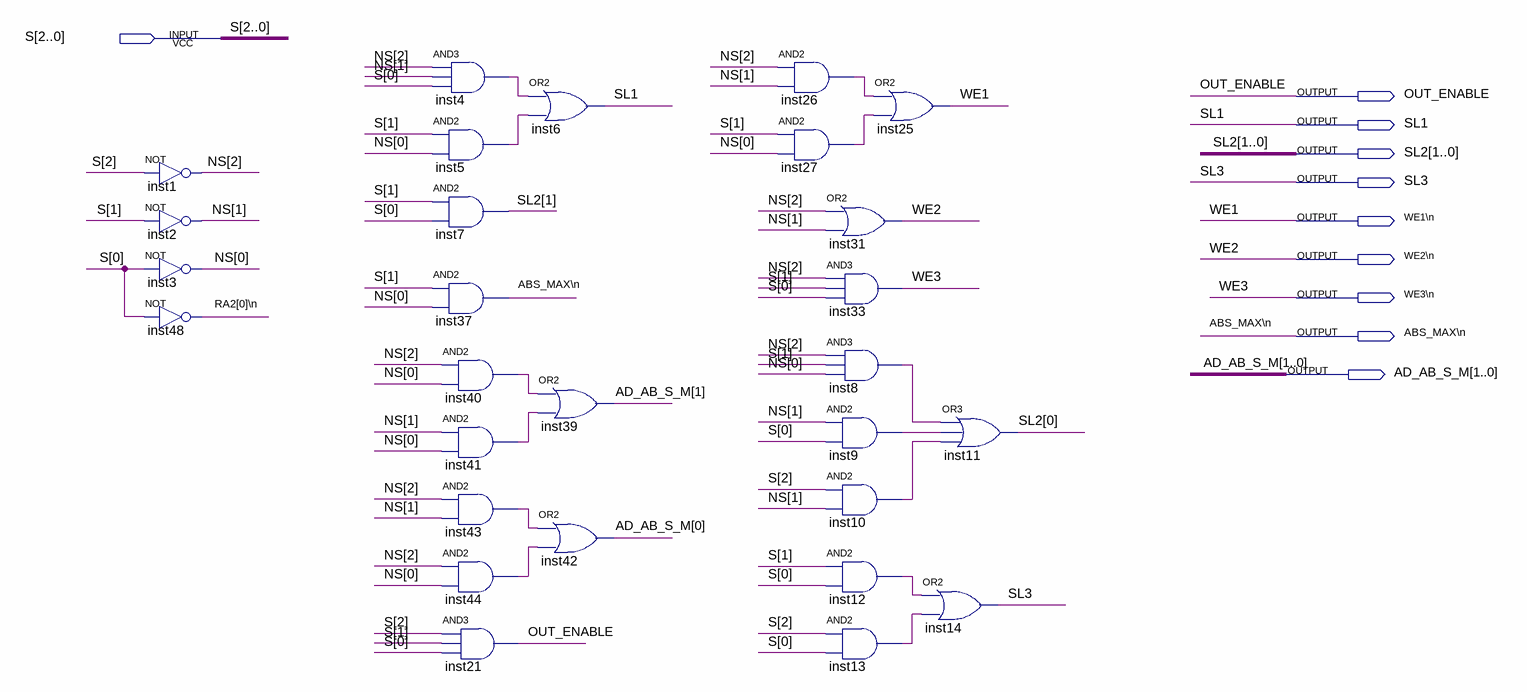
[diagram p0: schematic sheet]
// Quartus schematic sra_control.bdf as structural Verilog: 28 symbols, 10 pins
module sra_control (
  input  [2:0] S,
  output OUT_ENABLE,
  output SL1,
  output [1:0] SL2,
  output SL3,
  output \WE1\n ,
  output \WE2\n ,
  output \WE3\n ,
  output \ABS_MAX\n ,
  output [1:0] AD_AB_S_M
);

  wire inst4_out, inst5_out, inst8_out, inst9_out, inst10_out, inst12_out, inst13_out, inst26_out,
       inst27_out, inst40_out, inst41_out, inst43_out, inst44_out, \RA2[0]\n ;
  wire [2:0] NS;

  not inst1 (NS[2], S[2]);
  not inst2 (NS[1], S[1]);
  not inst3 (NS[0], S[0]);
  not inst48 (\RA2[0]\n , S[0]);
  and inst4 (inst4_out, NS[2], NS[1], S[0]);
  and inst5 (inst5_out, S[1], NS[0]);
  and inst7 (SL2[1], S[1], S[0]);
  and inst37 (\ABS_MAX\n , S[1], NS[0]);
  and inst40 (inst40_out, NS[2], NS[0]);
  and inst41 (inst41_out, NS[1], NS[0]);
  and inst43 (inst43_out, NS[2], NS[1]);
  and inst44 (inst44_out, NS[2], NS[0]);
  and inst21 (OUT_ENABLE, S[2], S[1], S[0]);
  or inst6 (SL1, inst4_out, inst5_out);
  or inst39 (AD_AB_S_M[1], inst40_out, inst41_out);
  or inst42 (AD_AB_S_M[0], inst43_out, inst44_out);
  and inst26 (inst26_out, NS[2], NS[1]);
  and inst27 (inst27_out, S[1], NS[0]);
  or inst25 (\WE1\n , inst26_out, inst27_out);
  or inst31 (\WE2\n , NS[2], NS[1]);
  and inst33 (\WE3\n , NS[2], S[1], S[0]);
  and inst8 (inst8_out, NS[2], S[1], NS[0]);
  and inst9 (inst9_out, NS[1], S[0]);
  and inst10 (inst10_out, S[2], NS[1]);
  and inst12 (inst12_out, S[1], S[0]);
  and inst13 (inst13_out, S[2], S[0]);
  or inst11 (SL2[0], inst8_out, inst9_out, inst10_out);
  or inst14 (SL3, inst12_out, inst13_out);

  // Other names for the same wires on the sheet: WE1 = \WE1\n ; WE2 = \WE2\n ; WE3 = \WE3\n 
endmodule
